# EAGLE design wire F (EAGLE 6.1)
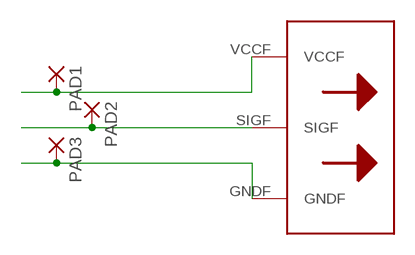
[diagram p0: schematic, sheet 1]

## Parts
PAD1  SMD5  [SMD2,54-5,08]
PAD2  SMD5  [SMD2,54-5,08]
PAD3  SMD5  [SMD2,54-5,08]
U$2  BITWIREF  [BITWIREF]

## Nets
N$1: PAD1.1(P) U$2.VCCF
N$2: PAD2.1(P) U$2.SIGF
N$3: PAD3.1(P) U$2.GNDF

## Library data of the parts
PAD1-PAD3 = wirepad:SMD5: SMD PAD
U$2 = bigbits:BITWIREF: Bit Wire Female Saída de Sinal -->>>>

## Board
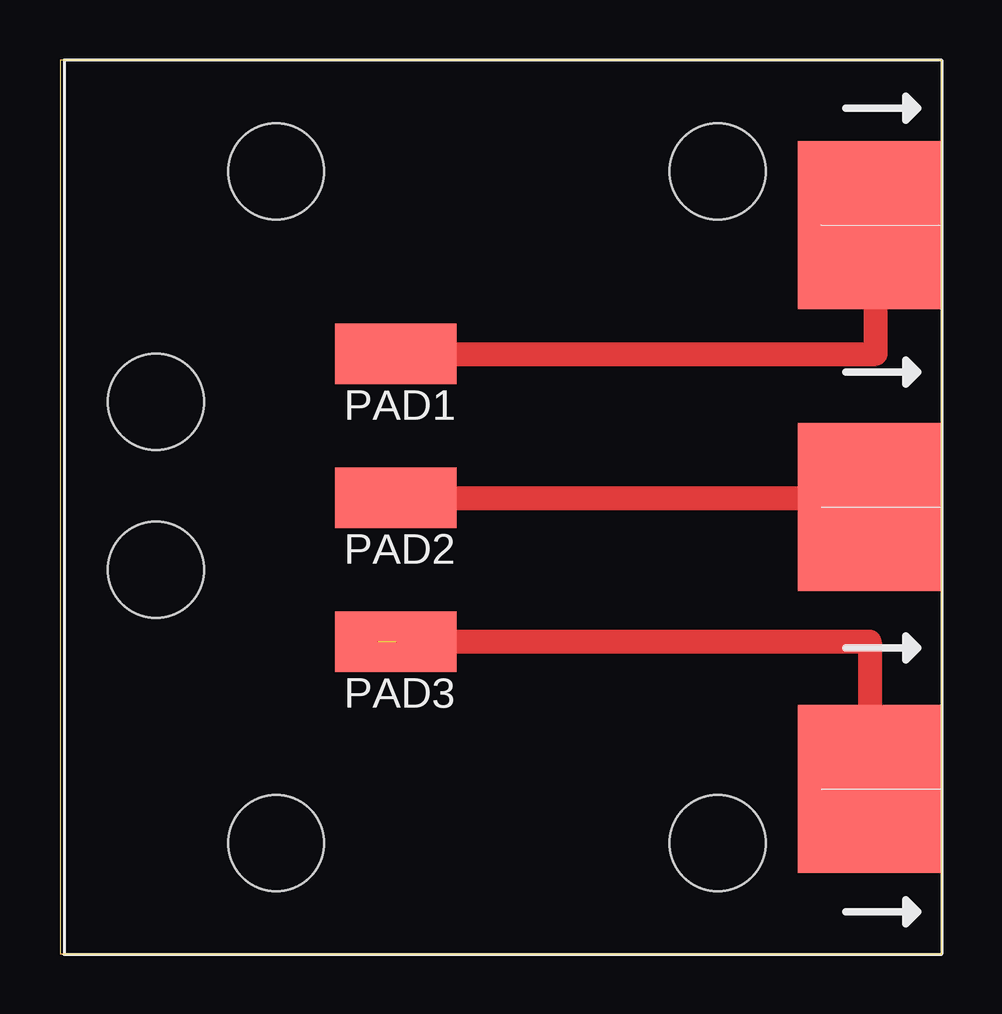
[diagram p1: board, top side]

Size 36.75 x 37.25 mm. Coordinates in mm from the lower left corner, seen from the top.
Outline: 0,0 36.75,0 36.75,37.25 0,37.25 0,0
Copper layers (1*16): Top 0.035mm / dielectric 1.5mm / Bottom 0.035mm
Design rules: minimum track width 10mil, minimum drill 24mil, track to track 8mil, track to pad 8mil, pad to pad 8mil, via to via 8mil, smd to smd 8mil, copper to edge 40mil, drill to drill 8mil, minimum pad ring 10mil, minimum via ring 8mil, stop-mask expansion 4mil, vias tented up to drill 0mil, thermal gap 10mil
Holes 4 mm at 4,23 4,16

### Footprints (pad centres in the part's own frame; a part is rotated, then mirrored left to right if it is on the bottom)
SMD2,54-5,08 = smd 2.54 x 5.08: 1 0,0
BITWIREF = smd 6 x 7: GNDF -3,-30.38; SIGF -3,-18.64; VCCF -3,-6.89 | hole 4: -9.34,-4.64; -9.34,-32.64; -27.74,-4.64; -27.74,-32.64

### Placement (x,y rotation side)
PAD1  14,25 90 top
PAD2  14,19 90 top
PAD3  14,13 90 top
U$2  36.75,37.25 0 top

### Tracks (layer width: path | path; a pad name or v marks a point on that pad's centre or on a via)
N$1
  Top 0.406: PAD1.1 33.75,25 U$2.VCCF
N$2
  Top 0.406: PAD2.1 33.75,19 U$2.SIGF
  Top 1: 33.75,18.75 U$2.SIGF
N$3  (1 unrouted)
  Top 1: U$2.GNDF 33.75,13 13.25,13
N$4
  Top 1: 16,25 34,25 34,30
N$5
  Top 1: 16,19 34,19